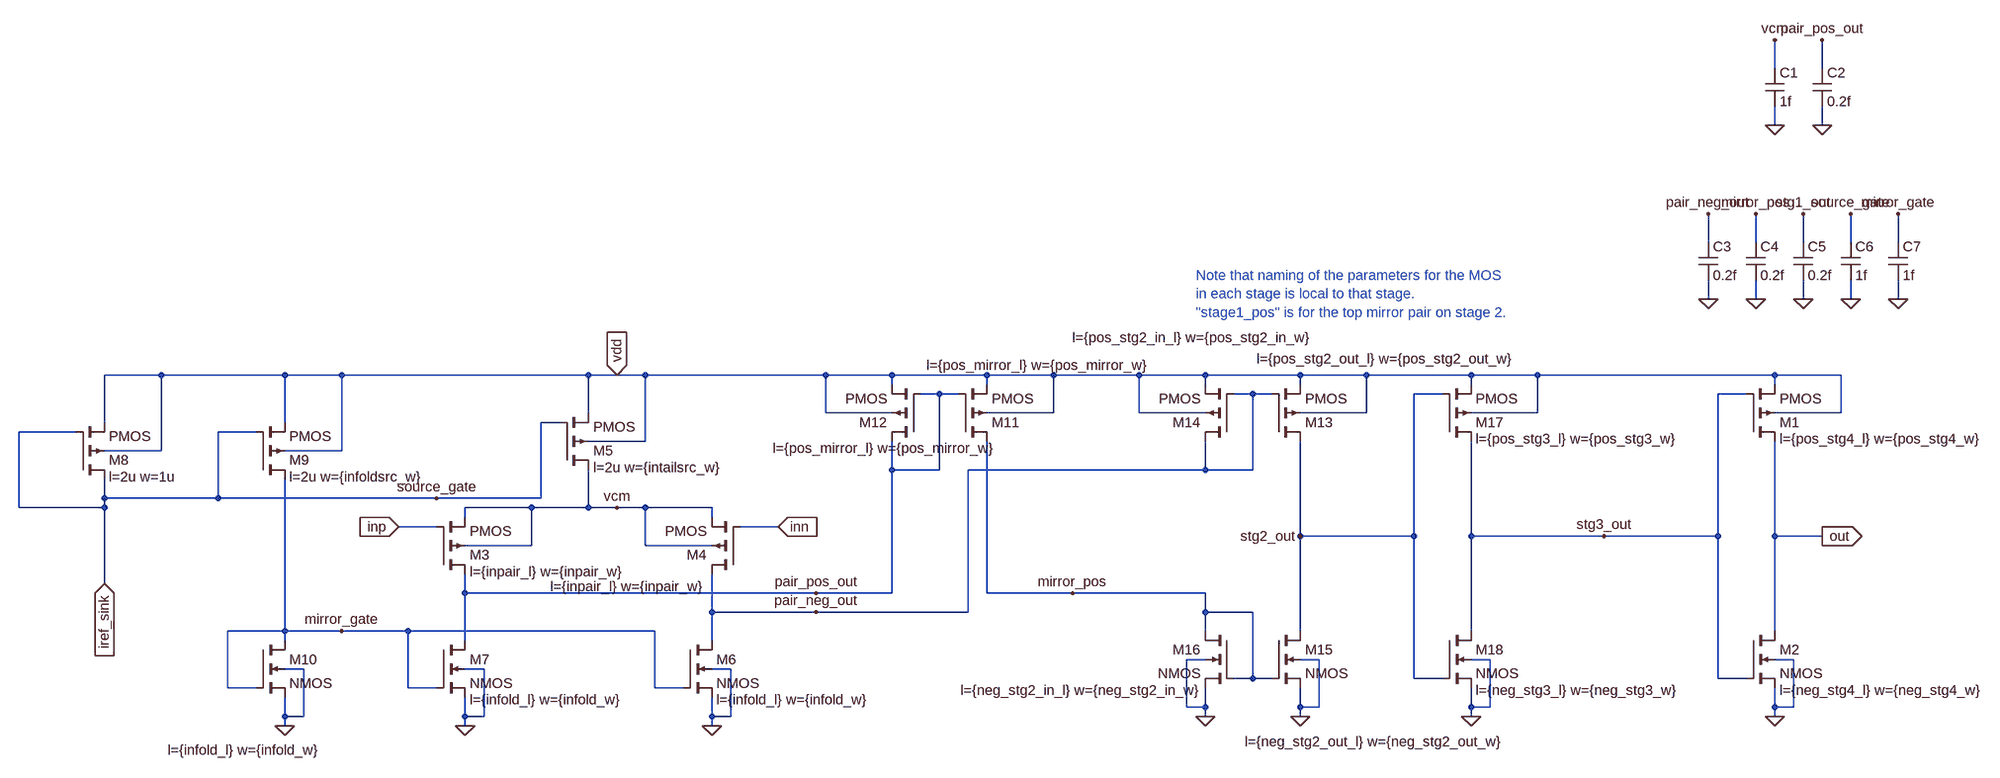
[diagram p0: schematic lvds_rcvr_v3.asc]
lvds_rcvr_v3.asc, the LTspice schematic file:
Version 4
SHEET 1 2912 1108
WIRE 2272 -208 2272 -256
WIRE 2352 -208 2352 -256
WIRE 2272 -112 2272 -144
WIRE 2352 -112 2352 -144
WIRE 2160 112 2160 64
WIRE 2240 112 2240 64
WIRE 2320 112 2320 64
WIRE 2400 112 2400 64
WIRE 2480 112 2480 64
WIRE 2160 208 2160 176
WIRE 2240 208 2240 176
WIRE 2320 208 2320 176
WIRE 2400 208 2400 176
WIRE 2480 208 2480 176
WIRE -448 336 -544 336
WIRE -240 336 -448 336
WIRE -144 336 -240 336
WIRE 272 336 -144 336
WIRE 320 336 272 336
WIRE 368 336 320 336
WIRE 672 336 368 336
WIRE 784 336 672 336
WIRE 944 336 784 336
WIRE 1056 336 944 336
WIRE 1200 336 1056 336
WIRE 1312 336 1200 336
WIRE 1472 336 1312 336
WIRE 1584 336 1472 336
WIRE 1760 336 1584 336
WIRE 1872 336 1760 336
WIRE 2272 336 1872 336
WIRE 2384 336 2272 336
WIRE 784 352 784 336
WIRE 944 352 944 336
WIRE 1312 352 1312 336
WIRE 1472 352 1472 336
WIRE 1760 352 1760 336
WIRE 2272 352 2272 336
WIRE 864 368 832 368
WIRE 896 368 864 368
WIRE 1392 368 1360 368
WIRE 1424 368 1392 368
WIRE 1712 368 1664 368
WIRE 2224 368 2176 368
WIRE 272 400 272 336
WIRE 672 400 672 336
WIRE 784 400 672 400
WIRE 1056 400 1056 336
WIRE 1056 400 944 400
WIRE 1200 400 1200 336
WIRE 1312 400 1200 400
WIRE 1584 400 1584 336
WIRE 1584 400 1472 400
WIRE 1872 400 1872 336
WIRE 1872 400 1760 400
WIRE 2384 400 2384 336
WIRE 2384 400 2272 400
WIRE -544 416 -544 336
WIRE -240 416 -240 336
WIRE 224 416 192 416
WIRE -592 432 -688 432
WIRE -288 432 -352 432
WIRE 368 448 368 336
WIRE 368 448 272 448
WIRE -448 464 -448 336
WIRE -448 464 -544 464
WIRE -144 464 -144 336
WIRE -144 464 -240 464
WIRE 784 496 784 448
WIRE 864 496 864 368
WIRE 864 496 784 496
WIRE 1312 496 1312 448
WIRE 1312 496 912 496
WIRE 1392 496 1392 368
WIRE 1392 496 1312 496
WIRE -544 544 -544 512
WIRE -352 544 -352 432
WIRE -352 544 -544 544
WIRE 16 544 -352 544
WIRE 192 544 192 416
WIRE 192 544 16 544
WIRE -688 560 -688 432
WIRE -544 560 -544 544
WIRE -544 560 -688 560
WIRE 176 560 64 560
WIRE 272 560 272 496
WIRE 272 560 176 560
WIRE 320 560 272 560
WIRE 368 560 320 560
WIRE 480 560 368 560
WIRE 64 576 64 560
WIRE 480 576 480 560
WIRE 16 592 -48 592
WIRE 592 592 528 592
WIRE 1472 608 1472 448
WIRE 1664 608 1664 368
WIRE 1664 608 1472 608
WIRE 1760 608 1760 448
WIRE 1984 608 1760 608
WIRE 2176 608 2176 368
WIRE 2176 608 1984 608
WIRE 2272 608 2272 448
WIRE 2352 608 2272 608
WIRE 176 624 176 560
WIRE 176 624 64 624
WIRE 368 624 368 560
WIRE 480 624 368 624
WIRE -544 688 -544 560
WIRE 64 704 64 672
WIRE 656 704 64 704
WIRE 784 704 784 496
WIRE 784 704 656 704
WIRE 944 704 944 448
WIRE 1088 704 944 704
WIRE 1312 704 1088 704
WIRE 480 736 480 672
WIRE 656 736 480 736
WIRE 912 736 912 496
WIRE 912 736 656 736
WIRE 1312 736 1312 704
WIRE 1392 736 1312 736
WIRE -240 768 -240 512
WIRE -240 768 -336 768
WIRE -144 768 -240 768
WIRE -32 768 -144 768
WIRE 384 768 -32 768
WIRE 1312 768 1312 736
WIRE 1472 768 1472 608
WIRE 1760 768 1760 608
WIRE 2272 768 2272 608
WIRE -240 784 -240 768
WIRE 64 784 64 704
WIRE 480 784 480 736
WIRE 1312 816 1280 816
WIRE 1504 816 1472 816
WIRE 1792 816 1760 816
WIRE 2304 816 2272 816
WIRE -208 832 -240 832
WIRE 96 832 64 832
WIRE 512 832 480 832
WIRE 1392 848 1392 736
WIRE 1392 848 1360 848
WIRE 1424 848 1392 848
WIRE 1664 848 1664 608
WIRE 1712 848 1664 848
WIRE 2176 848 2176 608
WIRE 2224 848 2176 848
WIRE -336 864 -336 768
WIRE -288 864 -336 864
WIRE -32 864 -32 768
WIRE 16 864 -32 864
WIRE 384 864 384 768
WIRE 432 864 384 864
WIRE 1280 896 1280 816
WIRE 1312 896 1312 864
WIRE 1312 896 1280 896
WIRE 1472 896 1472 864
WIRE 1504 896 1504 816
WIRE 1504 896 1472 896
WIRE 1760 896 1760 864
WIRE 1792 896 1792 816
WIRE 1792 896 1760 896
WIRE 2272 896 2272 864
WIRE 2304 896 2304 816
WIRE 2304 896 2272 896
WIRE -240 912 -240 880
WIRE -208 912 -208 832
WIRE -208 912 -240 912
WIRE 64 912 64 880
WIRE 96 912 96 832
WIRE 96 912 64 912
WIRE 480 912 480 880
WIRE 512 912 512 832
WIRE 512 912 480 912
WIRE 1312 912 1312 896
WIRE 1472 912 1472 896
WIRE 1760 912 1760 896
WIRE 2272 912 2272 896
WIRE -240 928 -240 912
WIRE 64 928 64 912
WIRE 480 928 480 912
FLAG 64 928 0
FLAG 480 928 0
FLAG 320 336 vdd
IOPIN 320 336 In
FLAG -48 592 inp
IOPIN -48 592 In
FLAG 592 592 inn
IOPIN 592 592 In
FLAG -240 928 0
FLAG -144 768 mirror_gate
FLAG 16 544 source_gate
FLAG 1472 912 0
FLAG 1312 912 0
FLAG 1088 704 mirror_pos
FLAG 1472 608 stg2_out
FLAG 656 704 pair_pos_out
FLAG 656 736 pair_neg_out
FLAG 1760 912 0
FLAG 2352 608 out
IOPIN 2352 608 Out
FLAG -544 688 iref_sink
IOPIN -544 688 In
FLAG 320 560 vcm
FLAG 2272 -112 0
FLAG 2272 -256 vcm
FLAG 2352 -112 0
FLAG 2352 -256 pair_pos_out
FLAG 2160 208 0
FLAG 2240 208 0
FLAG 2320 208 0
FLAG 2400 208 0
FLAG 2480 208 0
FLAG 2160 64 pair_neg_out
FLAG 2240 64 mirror_pos
FLAG 2320 64 stg1_out
FLAG 2400 64 source_gate
FLAG 2480 64 mirror_gate
FLAG 2272 912 0
FLAG 1984 608 stg3_out
SYMBOL pmos4 16 672 M180
WINDOW 123 56 4 Left 2
SYMATTR Value2 l={inpair_l} w={inpair_w}
SYMATTR InstName M3
SYMBOL pmos4 528 672 R180
WINDOW 123 61 -21 Left 2
SYMATTR Value2 l={inpair_l} w={inpair_w}
SYMATTR InstName M4
SYMBOL pmos4 224 496 M180
WINDOW 123 56 4 Left 2
SYMATTR Value2 l=2u w={intailsrc_w}
SYMATTR InstName M5
SYMBOL nmos4 432 784 R0
WINDOW 123 56 100 Left 2
SYMATTR Value2 l={infold_l} w={infold_w}
SYMATTR InstName M6
SYMBOL nmos4 16 784 R0
WINDOW 123 56 100 Left 2
SYMATTR Value2 l={infold_l} w={infold_w}
SYMATTR InstName M7
SYMBOL pmos4 -592 512 M180
WINDOW 123 56 4 Left 2
SYMATTR Value2 l=2u w=1u
SYMATTR InstName M8
SYMBOL pmos4 -288 512 M180
WINDOW 123 56 4 Left 2
SYMATTR Value2 l=2u w={infoldsrc_w}
SYMATTR InstName M9
SYMBOL nmos4 -288 784 R0
WINDOW 123 -149 185 Left 2
SYMATTR Value2 l={infold_l} w={infold_w}
SYMATTR InstName M10
SYMBOL pmos4 896 448 M180
WINDOW 123 -54 128 Left 2
SYMATTR Value2 l={pos_mirror_l} w={pos_mirror_w}
SYMATTR InstName M11
SYMBOL pmos4 832 448 R180
WINDOW 123 -124 -12 Left 2
SYMATTR Value2 l={pos_mirror_l} w={pos_mirror_w}
SYMATTR InstName M12
SYMBOL pmos4 1424 448 M180
WINDOW 123 -25 139 Left 2
SYMATTR Value2 l={pos_stg2_out_l} w={pos_stg2_out_w}
SYMATTR InstName M13
SYMBOL pmos4 1360 448 R180
WINDOW 123 -129 175 Left 2
SYMATTR Value2 l={pos_stg2_in_l} w={pos_stg2_in_w}
SYMATTR InstName M14
SYMBOL nmos4 1424 768 R0
WINDOW 123 -45 187 Left 2
SYMATTR Value2 l={neg_stg2_out_l} w={neg_stg2_out_w}
SYMATTR InstName M15
SYMBOL nmos4 1360 768 M0
WINDOW 123 56 100 Left 2
SYMATTR Value2 l={neg_stg2_in_l} w={neg_stg2_in_w}
SYMATTR InstName M16
SYMBOL pmos4 1712 448 M180
WINDOW 123 56 4 Left 2
SYMATTR Value2 l={pos_stg3_l} w={pos_stg3_w}
SYMATTR InstName M17
SYMBOL nmos4 1712 768 R0
WINDOW 123 56 100 Left 2
SYMATTR Value2 l={neg_stg3_l} w={neg_stg3_w}
SYMATTR InstName M18
SYMBOL cap 2256 -208 R0
SYMATTR InstName C1
SYMATTR Value 1f
SYMBOL cap 2336 -208 R0
SYMATTR InstName C2
SYMATTR Value 0.2f
SYMBOL cap 2144 112 R0
SYMATTR InstName C3
SYMATTR Value 0.2f
SYMBOL cap 2224 112 R0
SYMATTR InstName C4
SYMATTR Value 0.2f
SYMBOL cap 2304 112 R0
SYMATTR InstName C5
SYMATTR Value 0.2f
SYMBOL cap 2384 112 R0
SYMATTR InstName C6
SYMATTR Value 1f
SYMBOL cap 2464 112 R0
SYMATTR InstName C7
SYMATTR Value 1f
SYMBOL pmos4 2224 448 M180
WINDOW 123 56 4 Left 2
SYMATTR Value2 l={pos_stg4_l} w={pos_stg4_w}
SYMATTR InstName M1
SYMBOL nmos4 2224 768 R0
WINDOW 123 56 100 Left 2
SYMATTR Value2 l={neg_stg4_l} w={neg_stg4_w}
SYMATTR InstName M2
TEXT 1296 168 Left 2 ;Note that naming of the parameters for the MOS\nin each stage is local to that stage.\n"stage1_pos" is for the top mirror pair on stage 2.

The netlist it stands for:
* lvds_rcvr_v3.asc
M3 pair_pos_out inp vcm vcm PMOS l={inpair_l} w={inpair_w}
M4 pair_neg_out inn vcm vcm PMOS l={inpair_l} w={inpair_w}
M5 vcm iref_sink vdd vdd PMOS l=2u w={intailsrc_w}
M6 pair_neg_out mirror_gate 0 0 NMOS l={infold_l} w={infold_w}
M7 pair_pos_out mirror_gate 0 0 NMOS l={infold_l} w={infold_w}
M8 iref_sink iref_sink vdd vdd PMOS l=2u w=1u
M9 mirror_gate iref_sink vdd vdd PMOS l=2u w={infoldsrc_w}
M10 mirror_gate mirror_gate 0 0 NMOS l={infold_l} w={infold_w}
M11 mirror_pos pair_pos_out vdd vdd PMOS l={pos_mirror_l} w={pos_mirror_w}
M12 pair_pos_out pair_pos_out vdd vdd PMOS l={pos_mirror_l} w={pos_mirror_w}
M13 stg2_out pair_neg_out vdd vdd PMOS l={pos_stg2_out_l} w={pos_stg2_out_w}
M14 pair_neg_out pair_neg_out vdd vdd PMOS l={pos_stg2_in_l} w={pos_stg2_in_w}
M15 stg2_out mirror_pos 0 0 NMOS l={neg_stg2_out_l} w={neg_stg2_out_w}
M16 mirror_pos mirror_pos 0 0 NMOS l={neg_stg2_in_l} w={neg_stg2_in_w}
M17 stg3_out stg2_out vdd vdd PMOS l={pos_stg3_l} w={pos_stg3_w}
M18 stg3_out stg2_out 0 0 NMOS l={neg_stg3_l} w={neg_stg3_w}
C1 vcm 0 1f
C2 pair_pos_out 0 0.2f
C3 pair_neg_out 0 0.2f
C4 mirror_pos 0 0.2f
C5 stg1_out 0 0.2f
C6 iref_sink 0 1f
C7 mirror_gate 0 1f
M1 out stg3_out vdd vdd PMOS l={pos_stg4_l} w={pos_stg4_w}
M2 out stg3_out 0 0 NMOS l={neg_stg4_l} w={neg_stg4_w}
.model NMOS NMOS
.model PMOS PMOS
.lib standard.mos
* Note that naming of the parameters for the MOS
* in each stage is local to that stage.
* "stage1_pos" is for the top mirror pair on stage 2.
.backanno
.end